# Altium schematic sheet FLASH_S29GL128P11FFI010_128Mbit.SchDoc: 128M-bit Flash Memory (BGA)
size A4; Organization: Altium Limited.; Address1: Level 3, 12a Rodborough Rd; Address2: Frenchs Forest 2086; Address3: NSW; Address4: AUSTRALIA; SheetNumber: 1; SheetTotal: 100; PageSetup: Record=PageOptions|CenterHorizontal=True|CenterVertical=True|PrintScale=0.97|XCorrection=1.00|YCorrection=1.00|PrintKind=0|BorderSize=5000000|LeftOffset=0|BottomOffset=0|Orientation=2|PaperLength=1000|PaperWidth=1000|Scale=100|PaperSource=7|PrintQuality=-4|MediaType=1|DitherType=10|PaperKind=A3 (297 x 420mm)|PrintScaleMode=1
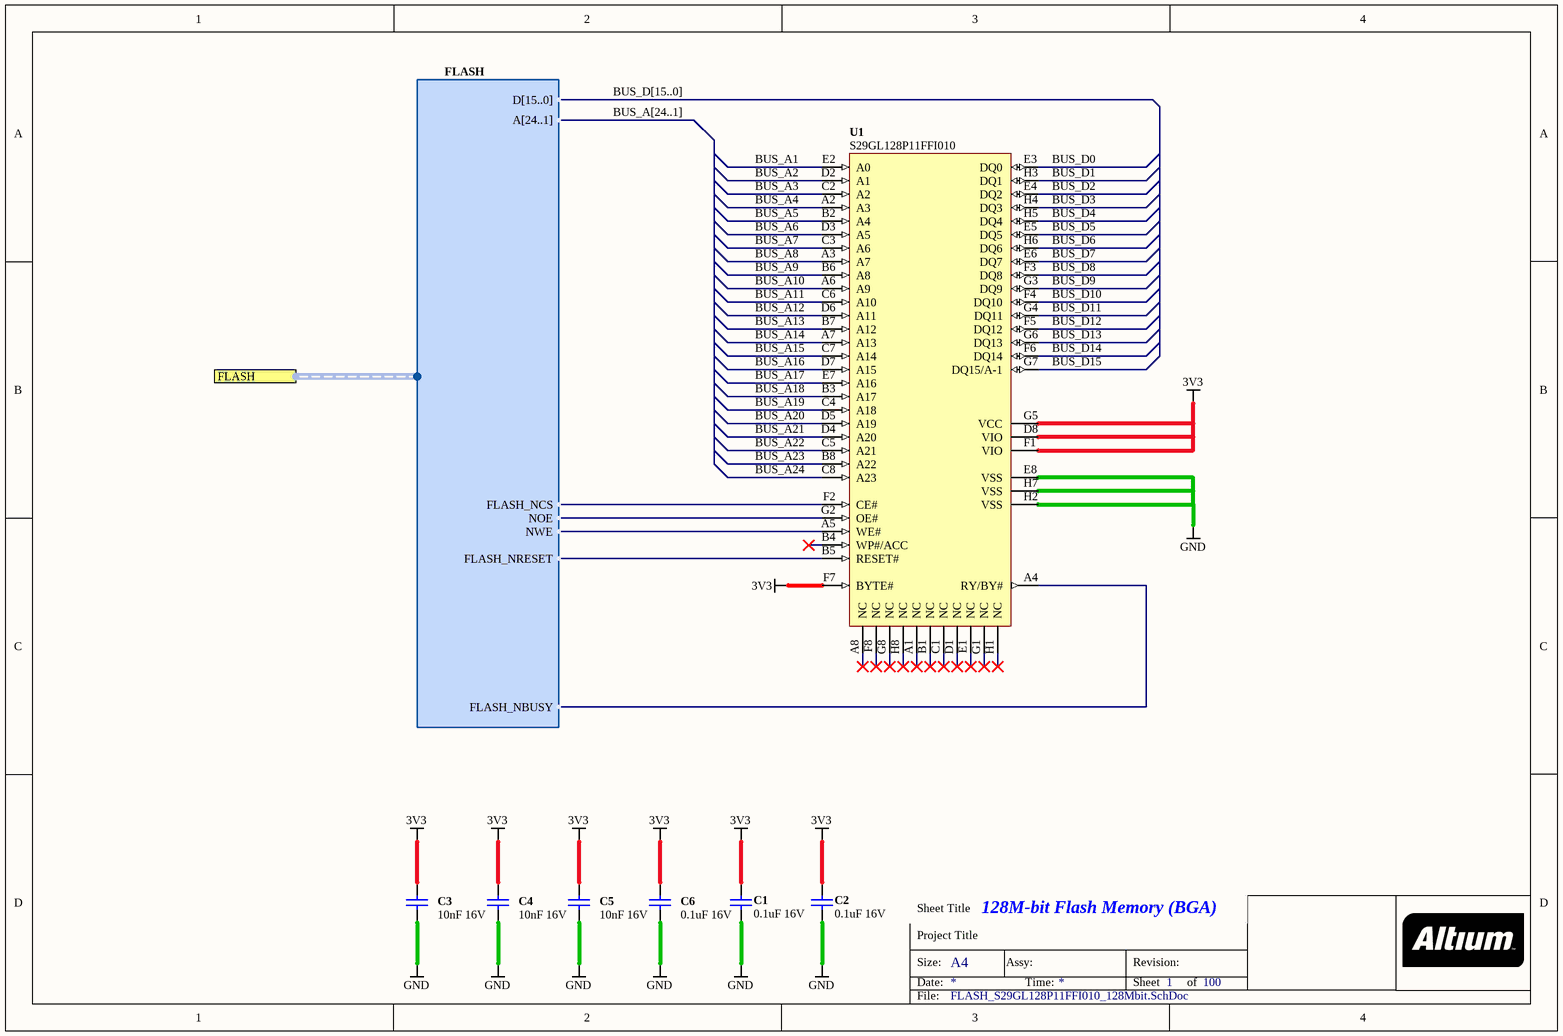
[diagram p0: FLASH_S29GL128P11FFI010_128Mbit.SchDoc]

## Parts
C1  0.1uF 16V  [CAPC1005-STAR]
C2  0.1uF 16V  [CAPC1005-STAR]
C3  10nF 16V  [CAPC1005-STAR]
C4  10nF 16V  [CAPC1005-STAR]
C5  10nF 16V  [CAPC1005-STAR]
C6  0.1uF 16V  [CAPC1005-STAR]
U1  S29GL128P11FFI010  [BGA100P8X8-64]

## Ports
FLASH (harness FLASH)

## Harnesses
FLASH: D[15..0], A[24..1], FLASH_NCS, NOE, NWE, FLASH_NRESET, FLASH_NBUSY

## Nets
3V3: C1.1 C2.1 C3.1 C4.1 C5.1 C6.1 U1.D8(VIO) U1.F1(VIO) U1.F7(BYTE#) U1.G5(VCC)
GND: C1.2 C2.2 C3.2 C4.2 C5.2 C6.2 U1.E8(VSS) U1.H2(VSS) U1.H7(VSS)
BUS_A1: U1.E2(A0)
BUS_A2: U1.D2(A1)
BUS_A3: U1.C2(A2)
BUS_A4: U1.A2(A3)
BUS_A5: U1.B2(A4)
BUS_A6: U1.D3(A5)
BUS_A7: U1.C3(A6)
BUS_A8: U1.A3(A7)
BUS_A9: U1.B6(A8)
BUS_A10: U1.A6(A9)
BUS_A11: U1.C6(A10)
BUS_A12: U1.D6(A11)
BUS_A13: U1.B7(A12)
BUS_A14: U1.A7(A13)
BUS_A15: U1.C7(A14)
BUS_A16: U1.D7(A15)
BUS_A17: U1.E7(A16)
BUS_A18: U1.B3(A17)
BUS_A19: U1.C4(A18)
BUS_A20: U1.D5(A19)
BUS_A21: U1.D4(A20)
BUS_A22: U1.C5(A21)
BUS_A23: U1.B8(A22)
BUS_A24: U1.C8(A23)
BUS_D0: U1.E3(DQ0)
BUS_D1: U1.H3(DQ1)
BUS_D2: U1.E4(DQ2)
BUS_D3: U1.H4(DQ3)
BUS_D4: U1.H5(DQ4)
BUS_D5: U1.E5(DQ5)
BUS_D6: U1.H6(DQ6)
BUS_D7: U1.E6(DQ7)
BUS_D8: U1.F3(DQ8)
BUS_D9: U1.G3(DQ9)
BUS_D10: U1.F4(DQ10)
BUS_D11: U1.G4(DQ11)
BUS_D12: U1.F5(DQ12)
BUS_D13: U1.G6(DQ13)
BUS_D14: U1.F6(DQ14)
BUS_D15: U1.G7(DQ15/A-1)
NetU1_A4: U1.A4(RY/BY#) ; port FLASH.FLASH_NBUSY
NetU1_A5: U1.A5(WE#) ; port FLASH.NWE
NetU1_B5: U1.B5(RESET#) ; port FLASH.FLASH_NRESET
NetU1_F2: U1.F2(CE#) ; port FLASH.FLASH_NCS
NetU1_G2: U1.G2(OE#) ; port FLASH.NOE

Not connected (* = marked no-connect by the designer): U1 A1(NC)* A8(NC)* B1(NC)* B4(WP#/ACC)* C1(NC)* D1(NC)* E1(NC)* F8(NC)* G1(NC)* G8(NC)* H1(NC)* H8(NC)*

## Buses and harness runs
bus BUS_A[24..1]
bus BUS_D[15..0]

## Notes on the sheet
- Sheet Title
- Project Title
- Size:
- Date:
- A4
- Assy:
- Time:
- Revision:
- Sheet
- of
- File:

## Library data of the parts
C1 C2 C6 = D-101-0080: Capacitor, Ceramic, 0.1uF 10% 16V 0402 (1005) X7R; Polarity: Non-Polarized; Category: Capacitor; Status: Production; Capacitance: 0.1 uF; Dielectric: X7R; Mounting Technology: Surface Mount; Rated Voltage: 16 V; Technology: Ceramic; Tolerance: 10 %
C3-C5 = D-101-0077: Capacitor, Ceramic, 10nF 10% 16V 0402 (1005) X7R; Polarity: Non-Polarized; Category: Capacitor; Status: Production; Capacitance: 10 nF; Dielectric: X7R; Mounting Technology: Surface Mount; Rated Voltage: 16 V; Technology: Ceramic; Tolerance: 10 %
U1 = D-262-0008: IC Flash, S29GL128P11FFI010 128 Megabit 3.0V Page Mode Flash Memory; Bit Length: Bits; Speed: ps; Supply Voltage: 3.3 V; Bit Width: Bits; Mounting Technology: Surface Mount; Status: Unreleased; Temperature Range: -40 to +85 degC; Category: IC-Flash